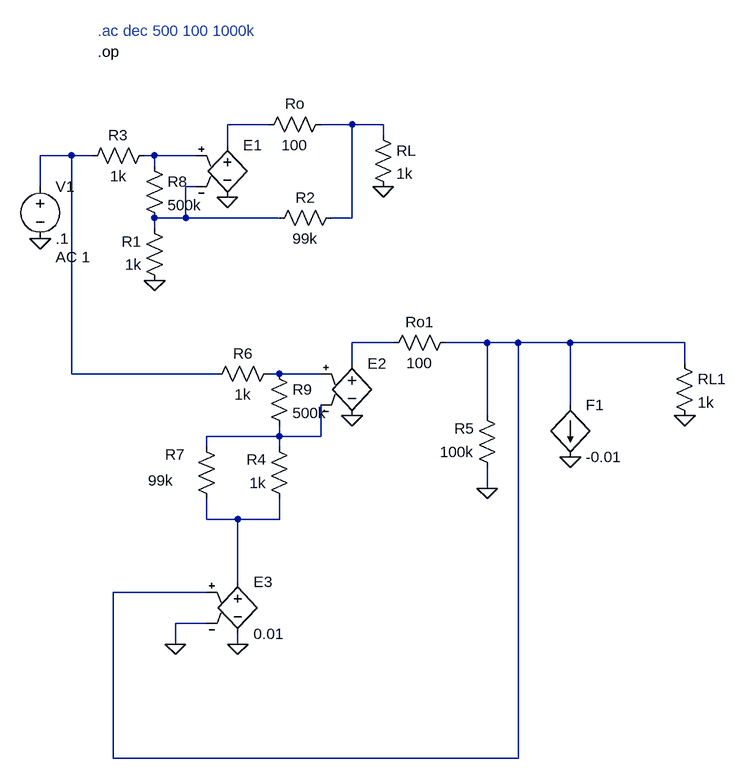
[diagram p0: schematic Transferencia1.asc]
Transferencia1.asc, the LTspice schematic file:
Version 4
SHEET 1 1012 1092
WIRE 304 112 240 112
WIRE 432 112 384 112
WIRE 480 112 432 112
WIRE 480 128 480 112
WIRE 240 144 240 112
WIRE 0 160 -48 160
WIRE 32 160 0 160
WIRE 128 160 112 160
WIRE 192 160 128 160
WIRE 128 176 128 160
WIRE -48 208 -48 160
WIRE 192 208 176 208
WIRE 176 256 176 208
WIRE 176 256 128 256
WIRE 320 256 176 256
WIRE 432 256 432 112
WIRE 432 256 400 256
WIRE 128 272 128 256
WIRE 496 448 432 448
WIRE 640 448 576 448
WIRE 688 448 640 448
WIRE 768 448 688 448
WIRE 944 448 768 448
WIRE 432 480 432 448
WIRE 944 480 944 448
WIRE 0 496 0 160
WIRE 224 496 0 496
WIRE 320 496 304 496
WIRE 384 496 320 496
WIRE 768 544 768 448
WIRE 640 560 640 448
WIRE 320 592 320 576
WIRE 320 592 208 592
WIRE 384 592 384 544
WIRE 384 592 320 592
WIRE 208 608 208 592
WIRE 320 608 320 592
WIRE 640 672 640 640
WIRE 208 720 208 688
WIRE 256 720 208 720
WIRE 320 720 320 688
WIRE 320 720 256 720
WIRE 256 816 256 720
WIRE 208 832 64 832
WIRE 208 880 160 880
WIRE 160 912 160 880
WIRE 256 912 256 896
WIRE 64 1088 64 832
WIRE 688 1088 688 448
WIRE 688 1088 64 1088
FLAG 240 224 0
FLAG 480 208 0
FLAG 128 352 0
FLAG -48 288 0
FLAG 432 560 0
FLAG 944 560 0
FLAG 256 912 0
FLAG 160 912 0
FLAG 640 672 0
FLAG 768 624 0
DATAFLAG 464 112 ""
DATAFLAG 816 448 ""
SYMBOL e 240 128 R0
WINDOW 3 24 96 Invisible 2
SYMATTR Value 1000/(1+s/62831.8)
SYMATTR InstName E1
SYMATTR SpiceModel laplace
SYMBOL res 400 96 R90
WINDOW 0 0 56 VBottom 2
WINDOW 3 32 56 VTop 2
SYMATTR InstName Ro
SYMATTR Value 100
SYMBOL res 464 112 R0
SYMATTR InstName RL
SYMATTR Value 1k
SYMBOL res 144 368 R180
WINDOW 0 36 76 Left 2
WINDOW 3 36 40 Left 2
SYMATTR InstName R1
SYMATTR Value 1k
SYMBOL res 416 240 R90
WINDOW 0 0 56 VBottom 2
WINDOW 3 32 56 VTop 2
SYMATTR InstName R2
SYMATTR Value 99k
SYMBOL res 128 144 R90
WINDOW 0 0 56 VBottom 2
WINDOW 3 32 56 VTop 2
SYMATTR InstName R3
SYMATTR Value 1k
SYMBOL voltage -48 192 R0
WINDOW 123 24 124 Left 2
WINDOW 39 0 0 Left 0
SYMATTR Value2 AC 1
SYMATTR InstName V1
SYMATTR Value .1
SYMBOL e 432 464 R0
WINDOW 3 24 96 Invisible 2
SYMATTR Value 1000/(1+s/62831.8)
SYMATTR InstName E2
SYMATTR SpiceModel laplace
SYMBOL res 592 432 R90
WINDOW 0 0 56 VBottom 2
WINDOW 3 32 56 VTop 2
SYMATTR InstName Ro1
SYMATTR Value 100
SYMBOL res 928 464 R0
SYMATTR InstName RL1
SYMATTR Value 1k
SYMBOL res 336 704 R180
WINDOW 0 36 76 Left 2
WINDOW 3 36 40 Left 2
SYMATTR InstName R4
SYMATTR Value 1k
SYMBOL res 656 656 R180
WINDOW 0 36 76 Left 2
WINDOW 3 36 40 Left 2
SYMATTR InstName R5
SYMATTR Value 100k
SYMBOL res 320 480 R90
WINDOW 0 0 56 VBottom 2
WINDOW 3 32 56 VTop 2
SYMATTR InstName R6
SYMATTR Value 1k
SYMBOL res 192 592 R0
WINDOW 0 -48 28 Left 2
WINDOW 3 -74 68 Left 2
SYMATTR InstName R7
SYMATTR Value 99k
SYMBOL e 256 800 R0
SYMATTR InstName E3
SYMATTR Value 0.01
SYMBOL f 768 544 R0
SYMATTR InstName F1
SYMATTR Value -0.01
SYMATTR SpiceModel e3
SYMBOL res 112 160 R0
SYMATTR InstName R8
SYMATTR Value 500k
SYMBOL res 304 480 R0
SYMATTR InstName R9
SYMATTR Value 500k
TEXT 40 0 Left 2 !.op
TEXT 40 -32 Left 2 ;.ac dec 500 100 1000k

The netlist it stands for:
* Transferencia1.asc
E1 N001 0 N004 N005 laplace 1000/(1+s/62831.8)
Ro N002 N001 100
RL N002 0 1k
R1 0 N005 1k
R2 N002 N005 99k
R3 N004 N003 1k
V1 N003 0 .1 AC 1
E2 N006 0 N008 N009 laplace 1000/(1+s/62831.8)
Ro1 N007 N006 100
RL1 N007 0 1k
R4 N010 N009 1k
R5 0 N007 100k
R6 N008 N003 1k
R7 N009 N010 99k
E3 N010 0 N007 0 0.01
F1 N007 0 e3 -0.01
R8 N004 N005 500k
R9 N008 N009 500k
.op
* .ac dec 500 100 1000k
.backanno
.end